# Altium schematic sheet Sheet1.SchDoc
size Letter; SheetNumber: 1; SheetTotal: 1
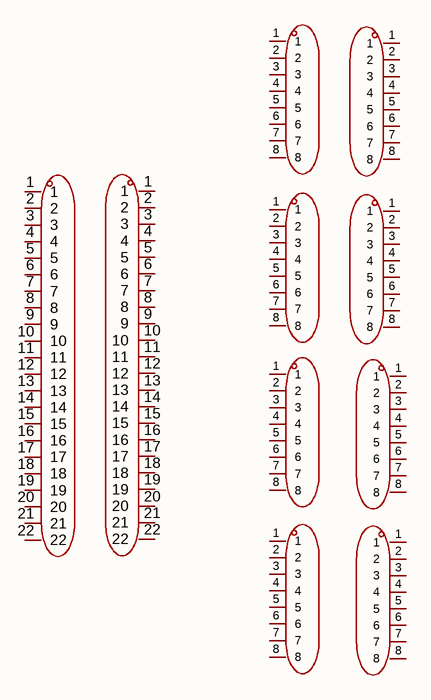
[diagram p0: Sheet1.SchDoc]

## Parts
(Parts that share a designator on the sheet are numbered #1, #2 ... from top to bottom, then left to right.)
P?#1  2.54-1*8p母环保  [HDR-TH_8P-P2.54-V-F]  (value not drawn)
P?#2  2.54-1*8p母环保  [HDR-TH_8P-P2.54-V-F]  (value not drawn)
P?#3  2.54-1*8p母环保  [HDR-TH_8P-P2.54-V-F]  (value not drawn)
P?#4  2.54-1*8p母环保  [HDR-TH_8P-P2.54-V-F]  (value not drawn)
P?#5  2.54-1*8p母环保  [HDR-TH_8P-P2.54-V-F]  (value not drawn)
P?#6  2.54-1*8p母环保  [HDR-TH_8P-P2.54-V-F]  (value not drawn)
P?#7  2.54-1*8p母环保  [HDR-TH_8P-P2.54-V-F]  (value not drawn)
P?#8  2.54-1*8p母环保  [HDR-TH_8P-P2.54-V-F]  (value not drawn)
U?#1  fh2.54-09-22pzd  [HDR-TH_22P-P2.54-V-F]  (value not drawn)
U?#2  fh2.54-09-22pzd  [HDR-TH_22P-P2.54-V-F]  (value not drawn)

## Nets

Not connected (* = marked no-connect by the designer): P?#1 1 2 3 4 5 6 7 8; P?#2 1 2 3 4 5 6 7 8; P?#3 1 2 3 4 5 6 7 8; P?#4 1 2 3 4 5 6 7 8; P?#5 1 2 3 4 5 6 7 8; P?#6 1 2 3 4 5 6 7 8; P?#7 1 2 3 4 5 6 7 8; P?#8 1 2 3 4 5 6 7 8; U?#1 1 2 3 4 5 6 7 8 9 10 11 12 13 14 15 16 17 18 19 20 21 22; U?#2 1 2 3 4 5 6 7 8 9 10 11 12 13 14 15 16 17 18 19 20 21 22

## Library data of the parts
P?#1-P?#8 = 2.54-1*8p母环保: Holes Structure:1x8P Pitch:2.54mm Row Spacing:- Circular Hole / Square Hole:Square Hole Mounting Type:Through Hole Number of Rows:1 Number of Positions:8P Current Rating:3A Holes Direction:Top Insulation Height:8.5mm Contact Material:Brass Contact Plating; Manufacturer: BOOMELE(博穆精密); Symbol: Header-Female-2.54_1x8; AddInBom: yes; ModelId: 6ab1dac21d924c3d8eea0dfa46d42ff5; ModelTransform: 819.723,98.425,0,0,0,0,0,0,-118.11; Holes Structure: 1x8P; Pitch: 2.54mm; Number of Positions: 8P; Current Rating: 3A; Holes Direction: Top; PIN Length: 3.2mm; LCSC Part Name: 1x8P 间距:2.54mm 直插; SupplierPart: C27438; ManufacturerPart: 2.54-1*8P母环保; Supplier Footprint: 插件,P=2.54mm; JLCPCB Part Class: Extended Part; Datasheet: https://item.szlcsc.com/datasheet/2.54-1*8P%25E6%25AF%258D%25E7%258E%25AF%25E4%25BF%259D/28187.html; Supplier: LCSC; ConvertToPcb: yes; FootprintName: HDR-TH_8P-P2.54-V-F; ModelName: HDR-TH_8P-P2.54-V-F; Row Spacing: -; Circular Hole / Square Hole: Square Hole; Mounting Type: Through Hole; Number of Rows: 1; Insulation Height: 8.5mm; Contact Material: Brass; Contact Plating: Gold; Operating Temperature: -55℃~+105℃
U?#1 U?#2 = fh2.54-09-22pzd: Holes Structure:1x22P Pitch:2.54mm Circular Hole / Square Hole:Square Hole Mounting Type:Through Hole Number of Rows:1 Number of Positions:22P Current Rating:3A Holes Direction:Top Insulation Height:8.5mm Contact Material:Brass Contact Plating:Gold Operat; Manufacturer: XUNPU(讯普); AddInBom: yes; ModelId: 676cdefe1703484f8a37377e34cf1f64; ModelTransform: 2199.99552,98.425,0,0,0,0,0,0,-125.984; Holes Structure: 1x22P; Pitch: 2.54mm; Number of Positions: 22P; Current Rating: 3A; Holes Direction: Top; PIN Length: 3.2mm; LCSC Part Name: 1x22P 间距:2.54mm 直插; SupplierPart: C7500786; ManufacturerPart: FH2.54-09-22PZD; Supplier Footprint: 插件,P=2.54mm; JLCPCB Part Class: Extended Part; Datasheet: https://item.szlcsc.com/datasheet/FH2.54-09-22PZD/8579590.html; Supplier: LCSC; ConvertToPcb: yes; SymbolName: FH2.54-09-22PZD; FootprintName: HDR-TH_22P-P2.54-V-F; ModelName: HDR-TH_22P-P2.54-V-F; Circular Hole / Square Hole: Square Hole; Mounting Type: Through Hole; Number of Rows: 1; Insulation Height: 8.5mm; Contact Material: Brass; Contact Plating: Gold; Operating Temperature: -40℃~+105℃